# Altium schematic sheet arm.SchDoc: Arm Schematic
size A4; Author: Rémi St-Onge; DrawnBy: Rémi St-Onge; DocumentName: Arm schematic
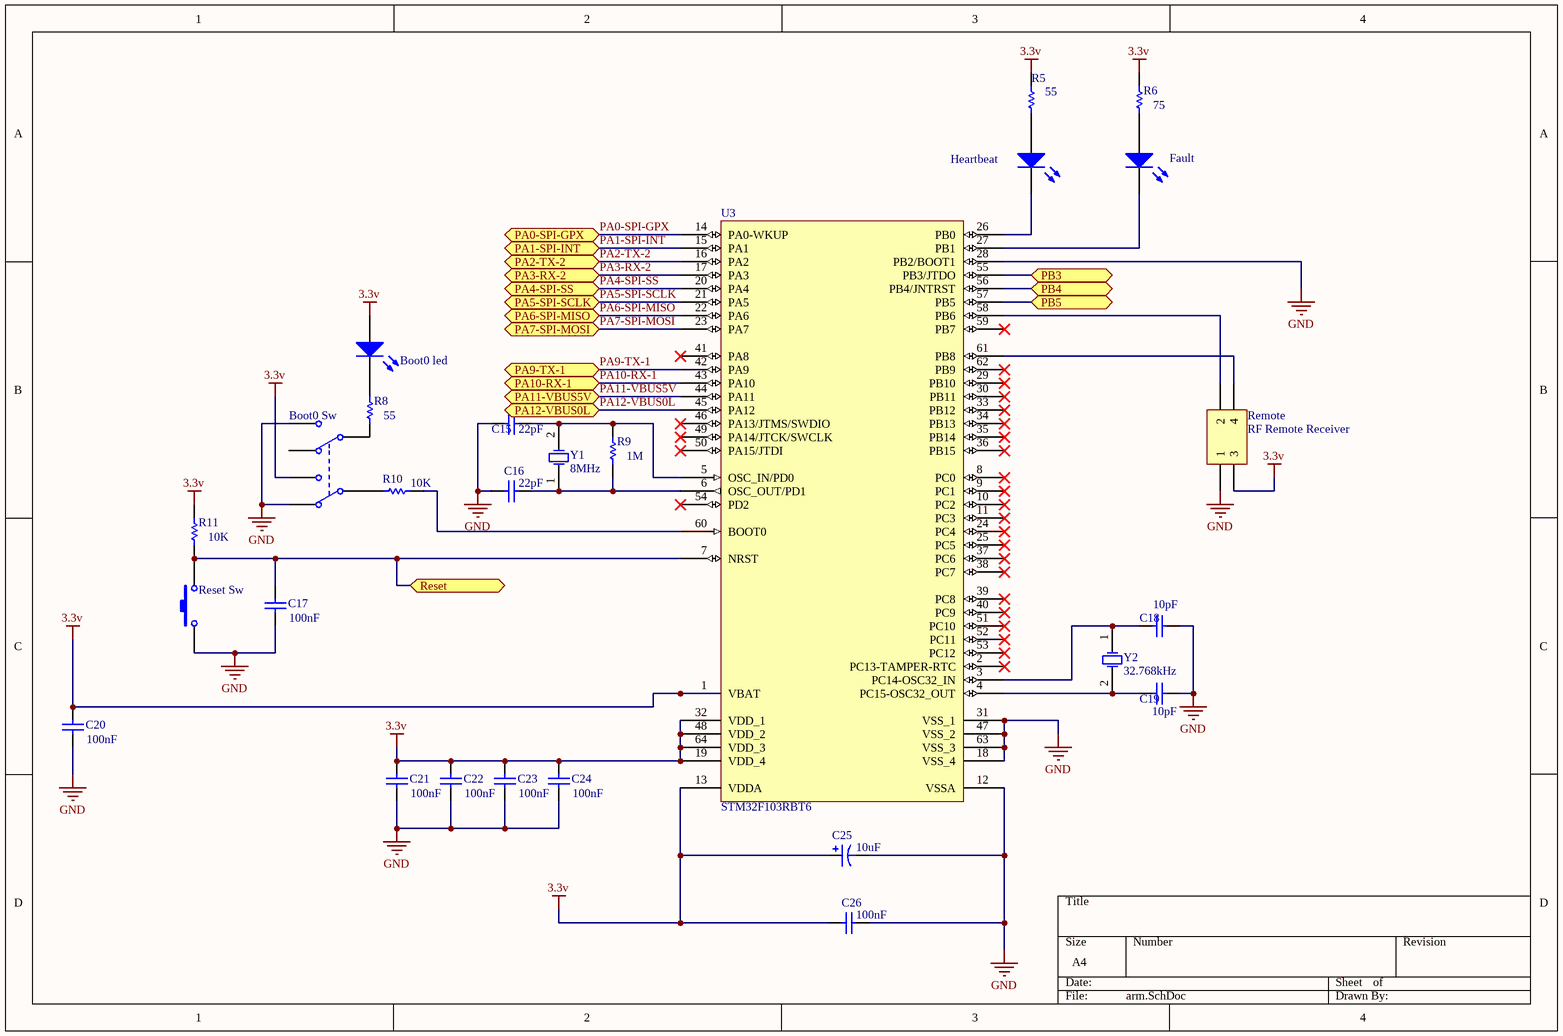
[diagram p0: arm.SchDoc]

## Parts
Boot0  Boot0 led  [3.2X1.6X1.1]
Boot0_Sw  BOOT0 SW  [Switch DPDT]  (value not drawn)
C15  value 22pF  [CAPC1608L]  (hidden comment: Cap)
C16  value 22pF  [CAPC1608L]  (hidden comment: Cap)
C17  value 100nF  [CAPC1608L]  (hidden comment: Cap)
C18  value 10pF  [CAPC1608L]  (hidden comment: Cap)
C19  value 10pF  [CAPC1608L]  (hidden comment: Cap)
C20  value 100nF  [CAPC1608L]  (hidden comment: Cap)
C21  value 100nF  [CAPC1608L]  (hidden comment: Cap)
C22  value 100nF  [CAPC1608L]  (hidden comment: Cap)
C23  value 100nF  [CAPC1608L]  (hidden comment: Cap)
C24  value 100nF  [CAPC1608L]  (hidden comment: Cap)
C25  value 10uF  [CAPC3216M]  (hidden comment: Cap Pol3)
C26  value 100nF  [CAPC1608L]  (hidden comment: Cap)
Fault  Fault LED  [3.2X1.6X1.1]  (value not drawn)
Heartbeat  Heartbeat LED  [3.2X1.6X1.1]  (value not drawn)
R5  value 55  [RESC1608L]  (hidden comment: Res1)
R6  value 75  [RESC1608L]  (hidden comment: Res1)
R8  value 55  [RESC1608L]  (hidden comment: Res1)
R9  value 1M  [RESC1608L]  (hidden comment: Res1)
R10  value 10K  [RESC1608L]  (hidden comment: Res1)
R11  value 10K  [RESC1608L]  (hidden comment: Res1)
Remote  RF Remote Receiver  [NES connector]
Reset_Sw  RESET SW  [tackSwitch]  (value not drawn)
U3  STM32F103RBT6  [LQFP64_N]
Y1  8MHz  [HC-49U]
Y2  32.768kHz  [R26]

## Ports
PA0-SPI-GPX, PA1-SPI-INT, PA2-TX-2, PA3-RX-2, PA4-SPI-SS, PA5-SPI-SCLK, PA6-SPI-MISO, PA7-SPI-MOSI, PA9-TX-1, PA10-RX-1, PA11-VBUS5V, PA12-VBUS0L, PB3 (bidir), PB4 (bidir), PB5 (bidir), Reset

## Nets
3.3v: Boot0.1(A) Boot0_Sw.2(NO1) C20.2 C21.2 C22.2 C23.2 C24.2 C25.1 C26.1 R5.2 R6.2 R11.2 Remote.3 U3.1(VBAT) U3.13(VDDA) U3.19(VDD_4) U3.32(VDD_1) U3.48(VDD_2) U3.64(VDD_3)
GND: Boot0_Sw.1(NC1) Boot0_Sw.6(NO2) C15.1 C16.1 C17.1 C18.1 C19.1 C20.1 C21.1 C22.1 C23.1 C24.1 C25.2 C26.2 Remote.1 Reset_Sw.1 U3.12(VSSA) U3.18(VSS_4) U3.28(PB2/BOOT1) U3.31(VSS_1) U3.47(VSS_2) U3.63(VSS_3)
PA0-SPI-GPX: U3.14(PA0-WKUP) ; port PA0-SPI-GPX
PA1-SPI-INT: U3.15(PA1) ; port PA1-SPI-INT
PA2-TX-2: U3.16(PA2) ; port PA2-TX-2
PA3-RX-2: U3.17(PA3) ; port PA3-RX-2
PA4-SPI-SS: U3.20(PA4) ; port PA4-SPI-SS
PA5-SPI-SCLK: U3.21(PA5) ; port PA5-SPI-SCLK
PA6-SPI-MISO: U3.22(PA6) ; port PA6-SPI-MISO
PA7-SPI-MOSI: U3.23(PA7) ; port PA7-SPI-MOSI
PA9-TX-1: U3.42(PA9) ; port PA9-TX-1
PA10-RX-1: U3.43(PA10) ; port PA10-RX-1
PA11-VBUS5V: U3.44(PA11) ; port PA11-VBUS5V
PA12-VBUS0L: U3.45(PA12) ; port PA12-VBUS0L
PB3: U3.55(PB3/JTDO) ; port PB3
PB4: U3.56(PB4/JNTRST) ; port PB4
PB5: U3.57(PB5) ; port PB5
Reset: C17.2 R11.1 Reset_Sw.2 U3.7(NRST) ; port Reset
NetBoot0_2: Boot0.2(K) R8.2
NetBoot0_Sw_3: Boot0_Sw.3(COMMON1) R10.1
NetBoot0_Sw_4: Boot0_Sw.4(COMMON2) R8.1
NetC15_2: C15.2 R9.1 U3.5(OSC_IN/PD0) Y1.2(OSC2)
NetC16_2: C16.2 R9.2 U3.6(OSC_OUT/PD1) Y1.1(OSC1)
NetC18_2: C18.2 U3.3(PC14-OSC32_IN) Y2.1(OSC1)
NetC19_2: C19.2 U3.4(PC15-OSC32_OUT) Y2.2(OSC2)
NetFault_1: Fault.1(A) R6.1
NetFault_2: Fault.2(K) U3.27(PB1)
NetHeartbeat_1: Heartbeat.1(A) R5.1
NetHeartbeat_2: Heartbeat.2(K) U3.26(PB0)
NetR10_2: R10.2 U3.60(BOOT0)
NetRemote_2: Remote.2 U3.58(PB6)
NetRemote_4: Remote.4 U3.61(PB8)

Not connected (* = marked no-connect by the designer): Boot0_Sw 5(NC2); U3 2(PC13-TAMPER-RTC)* 8(PC0)* 9(PC1)* 10(PC2)* 11(PC3)* 24(PC4)* 25(PC5)* 29(PB10)* 30(PB11)* 33(PB12)* 34(PB13)* 35(PB14)* 36(PB15)* 37(PC6)* 38(PC7)* 39(PC8)* 40(PC9)* 41(PA8)* 46(PA13/JTMS/SWDIO)* 49(PA14/JTCK/SWCLK)* 50(PA15/JTDI)* 51(PC10)* 52(PC11)* 53(PC12)* 54(PD2)* 59(PB7)* 62(PB9)*

## Library data of the parts
Boot0 Fault Heartbeat = LED2: Typical RED, GREEN, YELLOW, AMBER GaAs LED; Published: 8-Jun-2000; LatestRevisionDate: 17-Jul-2002; LatestRevisionNote: Re-released for DXP Platform.; PackageVersion: Feb-2002; PackageReference: 3.2X1.6X1.1; Publisher: Altium Limited
Boot0_Sw = SW DPDT: Switch; Published: 24-Mar-1999; LatestRevisionDate: 29-May-2009; LatestRevisionNote: IPC-7351 Footprint Added.; PackageVersion: Mar-2001; PackageReference: SOT23-6; Publisher: Altium Limited; PackageDescription: 6-Pin SOT-23 Package 0.95 mm Pitch, 2.7 mm Lead Span; Code_JEITA: SC-74; Code_IPC: SOT26A-6
C15-C24 C26 = Cap: Capacitor; Published: 8-Jun-2000; LatestRevisionDate: 17-Jul-2002; LatestRevisionNote: Re-released for DXP Platform.; PackageReference: RAD-0.3; Publisher: Altium Limited
C25 = Cap Pol3: Polarized Capacitor (Surface Mount); Published: 8-Jun-2000; LatestRevisionDate: 29-May-2009; LatestRevisionNote: IPC-7351 Footprint Added.; PackageReference: C0805; Publisher: Altium Limited; PackageDescription: Chip Capacitor
R5 R6 R8-R11 = Res1: Resistor; Published: 8-Jun-2000; LatestRevisionDate: 17-Jul-2002; LatestRevisionNote: Re-released for DXP Platform.; PackageReference: AXIAL-0.3; Publisher: Altium Limited
Remote = Header 2X2: Header, 2-Pin, Dual row; LatestRevisionDate: 17-Jul-2002; LatestRevisionNote: Re-released for DXP Platform.; Publisher: Altium Limited
Reset_Sw = SW-PB: Switch; Published: 24-Mar-1999; LatestRevisionDate: 17-Jul-2002; LatestRevisionNote: Re-released for DXP Platform.; PackageReference: SPST-2; Publisher: Altium Limited
U3 = STM32F103RBT6: STM32 ARM-based 32-bit MCU with 128 Kbytes Flash, 64-pin LQFP, Industrial Temperature; Published: 30-May-2008; DatasheetVersion: rev6, Mar-2008; PackageVersion: Mar-2008; PackageReference: LQFP64; Publisher: Altium Limited; PackageDescription: 64-Pin Low-Profile Quad Flat Pack, 10 x 10 mm Body, 0.5 mm Pitch (LQFP64); ComponentLink1Description: Manufacturer Link; ComponentLink1URL: www.st.com/stm32; ComponentLink2Description: Datasheet; ComponentLink2URL: http://www.st.com/stonline/products/literature/ds/13587.pdf
Y1 Y2 = XTAL: Crystal Oscillator; Published: 8-Jun-2000; LatestRevisionDate: 17-Jul-2002; LatestRevisionNote: Re-released for DXP Platform.; PackageReference: R38; Publisher: Altium Limited